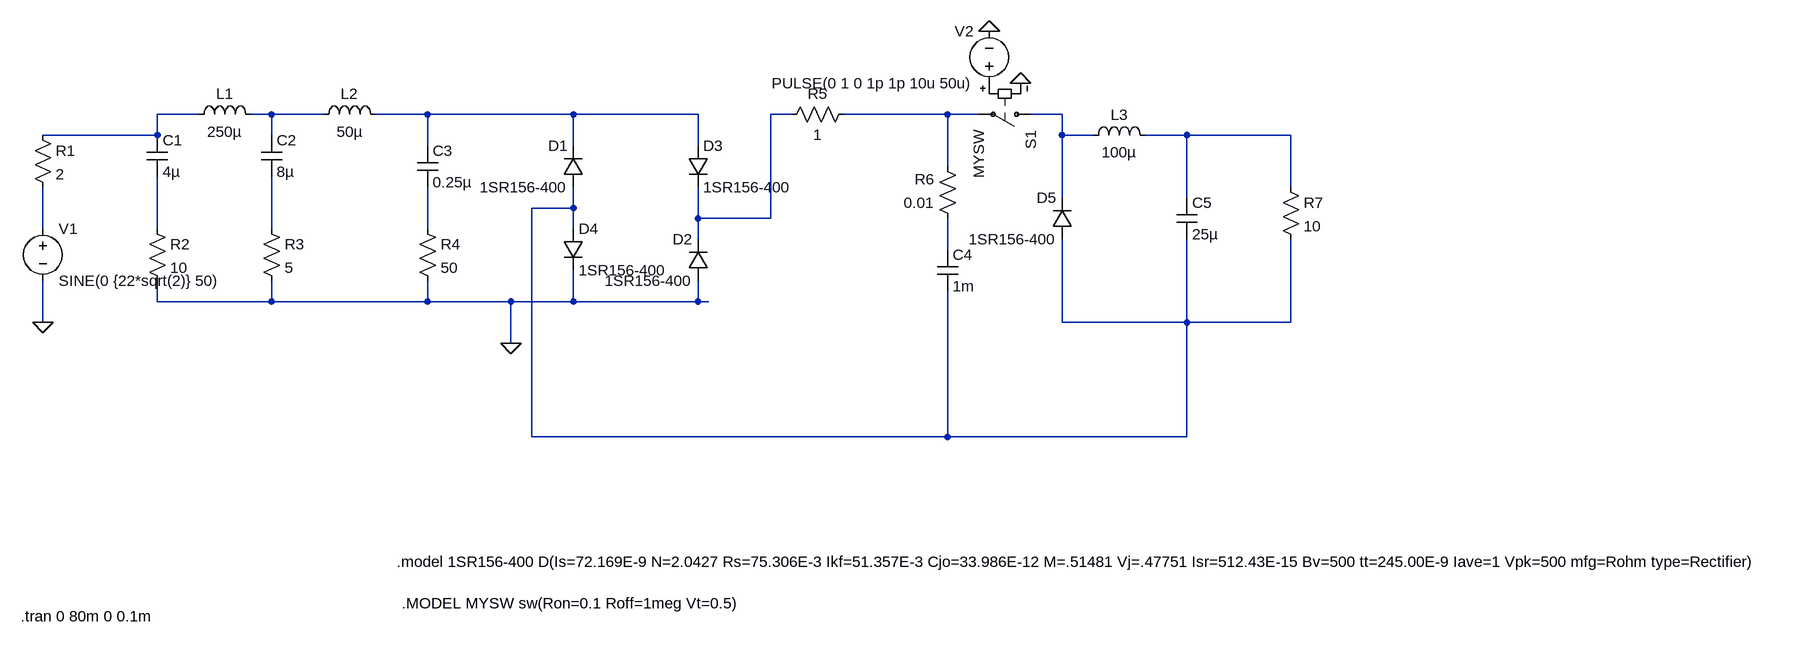
[diagram p0: schematic Zadatak02.asc]
Zadatak02.asc, the LTspice schematic file:
Version 4
SHEET 1 2928 740
WIRE 288 -48 224 -48
WIRE 400 -48 368 -48
WIRE 480 -48 400 -48
WIRE 640 -48 560 -48
WIRE 864 -48 640 -48
WIRE 1056 -48 864 -48
WIRE 1200 -48 1168 -48
WIRE 1440 -48 1280 -48
WIRE 1488 -48 1440 -48
WIRE 1616 -48 1568 -48
WIRE 224 -16 224 -48
WIRE 224 -16 48 -16
WIRE 400 -16 400 -48
WIRE 1616 -16 1616 -48
WIRE 1664 -16 1616 -16
WIRE 1808 -16 1744 -16
WIRE 1968 -16 1808 -16
WIRE 640 0 640 -48
WIRE 864 0 864 -48
WIRE 1056 0 1056 -48
WIRE 1440 32 1440 -48
WIRE 1968 64 1968 -16
WIRE 1616 80 1616 -16
WIRE 1808 80 1808 -16
WIRE 864 96 864 64
WIRE 864 96 800 96
WIRE 1056 112 1056 64
WIRE 1168 112 1168 -48
WIRE 1168 112 1056 112
WIRE 48 128 48 64
WIRE 224 128 224 48
WIRE 400 128 400 48
WIRE 640 128 640 64
WIRE 864 128 864 96
WIRE 1056 144 1056 112
WIRE 1440 160 1440 112
WIRE 224 240 224 208
WIRE 400 240 400 208
WIRE 400 240 224 240
WIRE 640 240 640 208
WIRE 640 240 400 240
WIRE 768 240 640 240
WIRE 864 240 864 192
WIRE 864 240 768 240
WIRE 1056 240 1056 208
WIRE 1056 240 864 240
WIRE 1072 240 1056 240
WIRE 48 272 48 208
WIRE 1616 272 1616 144
WIRE 1808 272 1808 144
WIRE 1808 272 1616 272
WIRE 1968 272 1968 144
WIRE 1968 272 1808 272
WIRE 768 304 768 240
WIRE 800 448 800 96
WIRE 1440 448 1440 224
WIRE 1440 448 800 448
WIRE 1808 448 1808 272
WIRE 1808 448 1440 448
FLAG 48 272 0
FLAG 768 304 0
FLAG 1504 -176 0
FLAG 1552 -96 0
SYMBOL res 32 -32 R0
SYMATTR InstName R1
SYMATTR Value 2
SYMBOL cap 208 -16 R0
SYMATTR InstName C1
SYMATTR Value 4µ
SYMBOL res 208 112 R0
SYMATTR InstName R2
SYMATTR Value 10
SYMBOL res 384 112 R0
SYMATTR InstName R3
SYMATTR Value 5
SYMBOL cap 384 -16 R0
SYMATTR InstName C2
SYMATTR Value 8µ
SYMBOL ind 272 -32 R270
WINDOW 0 32 56 VTop 2
WINDOW 3 5 56 VBottom 2
SYMATTR InstName L1
SYMATTR Value 250µ
SYMBOL ind 464 -32 R270
WINDOW 0 32 56 VTop 2
WINDOW 3 5 56 VBottom 2
SYMATTR InstName L2
SYMATTR Value 50µ
SYMBOL cap 624 0 R0
SYMATTR InstName C3
SYMATTR Value 0.25µ
SYMBOL res 624 112 R0
SYMATTR InstName R4
SYMATTR Value 50
SYMBOL diode 880 64 R180
WINDOW 0 24 64 Left 2
WINDOW 3 24 0 Left 2
SYMATTR InstName D1
SYMATTR Value 1SR156-400
SYMBOL diode 1072 208 R180
WINDOW 0 24 64 Left 2
WINDOW 3 24 0 Left 2
SYMATTR InstName D2
SYMATTR Value 1SR156-400
SYMBOL diode 1040 0 R0
SYMATTR InstName D3
SYMATTR Value 1SR156-400
SYMBOL diode 848 128 R0
SYMATTR InstName D4
SYMATTR Value 1SR156-400
SYMBOL res 1296 -64 R90
WINDOW 0 0 56 VBottom 2
WINDOW 3 32 56 VTop 2
SYMATTR InstName R5
SYMATTR Value 1
SYMBOL res 1456 128 R180
WINDOW 0 36 76 Left 2
WINDOW 3 36 40 Left 2
SYMATTR InstName R6
SYMATTR Value 0.01
SYMBOL cap 1424 160 R0
SYMATTR InstName C4
SYMATTR Value 1m
SYMBOL diode 1632 144 R180
WINDOW 0 24 64 Left 2
WINDOW 3 24 0 Left 2
SYMATTR InstName D5
SYMATTR Value 1SR156-400
SYMBOL ind 1648 0 R270
WINDOW 0 32 56 VTop 2
WINDOW 3 5 56 VBottom 2
SYMATTR InstName L3
SYMATTR Value 100µ
SYMBOL cap 1792 80 R0
SYMATTR InstName C5
SYMATTR Value 25µ
SYMBOL res 1952 48 R0
SYMATTR InstName R7
SYMATTR Value 10
SYMBOL sw 1584 -48 R90
SYMATTR InstName S1
SYMATTR Value MYSW
SYMBOL voltage 1504 -80 R180
WINDOW 0 24 96 Left 2
WINDOW 3 24 16 Left 2
WINDOW 123 0 0 Left 0
WINDOW 39 0 0 Left 0
SYMATTR InstName V2
SYMATTR Value PULSE(0 1 0 1p 1p 10u 50u)
SYMBOL voltage 48 112 R0
WINDOW 123 0 0 Left 0
WINDOW 39 0 0 Left 0
SYMATTR InstName V1
SYMATTR Value SINE(0 {22*sqrt(2)} 50)
TEXT 592 640 Left 2 !.model 1SR156-400 D(Is=72.169E-9 N=2.0427 Rs=75.306E-3 Ikf=51.357E-3 Cjo=33.986E-12 M=.51481 Vj=.47751 Isr=512.43E-15 Bv=500 tt=245.00E-9 Iave=1 Vpk=500 mfg=Rohm type=Rectifier)
TEXT 600 704 Left 2 !.MODEL MYSW sw(Ron=0.1 Roff=1meg Vt=0.5)
TEXT 14 724 Left 2 !.tran 0 80m 0 0.1m

The netlist it stands for:
* Zadatak02.asc
R1 N001 N009 2
C1 N001 N010 4µ
R2 N010 0 10
R3 N011 0 5
C2 N002 N011 8µ
L1 N001 N002 250µ
L2 N002 N003 50µ
C3 N003 N012 0.25µ
R4 N012 0 50
D1 N008 N003 1SR156-400
D2 0 N004 1SR156-400
D3 N003 N004 1SR156-400
D4 N008 0 1SR156-400
R5 N005 N004 1
R6 N013 N005 0.01
C4 N013 N008 1m
D5 N008 N006 1SR156-400
L3 N006 N007 100µ
C5 N007 N008 25µ
R7 N007 N008 10
S1 N006 N005 P001 0 MYSW
V2 P001 0 PULSE(0 1 0 1p 1p 10u 50u)
V1 N009 0 SINE(0 {22*sqrt(2)} 50)
.model D D
.lib standard.dio
.model 1SR156-400 D(Is=72.169E-9 N=2.0427 Rs=75.306E-3 Ikf=51.357E-3 Cjo=33.986E-12 M=.51481 Vj=.47751 Isr=512.43E-15 Bv=500 tt=245.00E-9 Iave=1 Vpk=500 mfg=Rohm type=Rectifier)
.MODEL MYSW sw(Ron=0.1 Roff=1meg Vt=0.5)
.tran 0 80m 0 0.1m
.backanno
.end